# Altium schematic sheet Sheet1.SchDoc
size A2
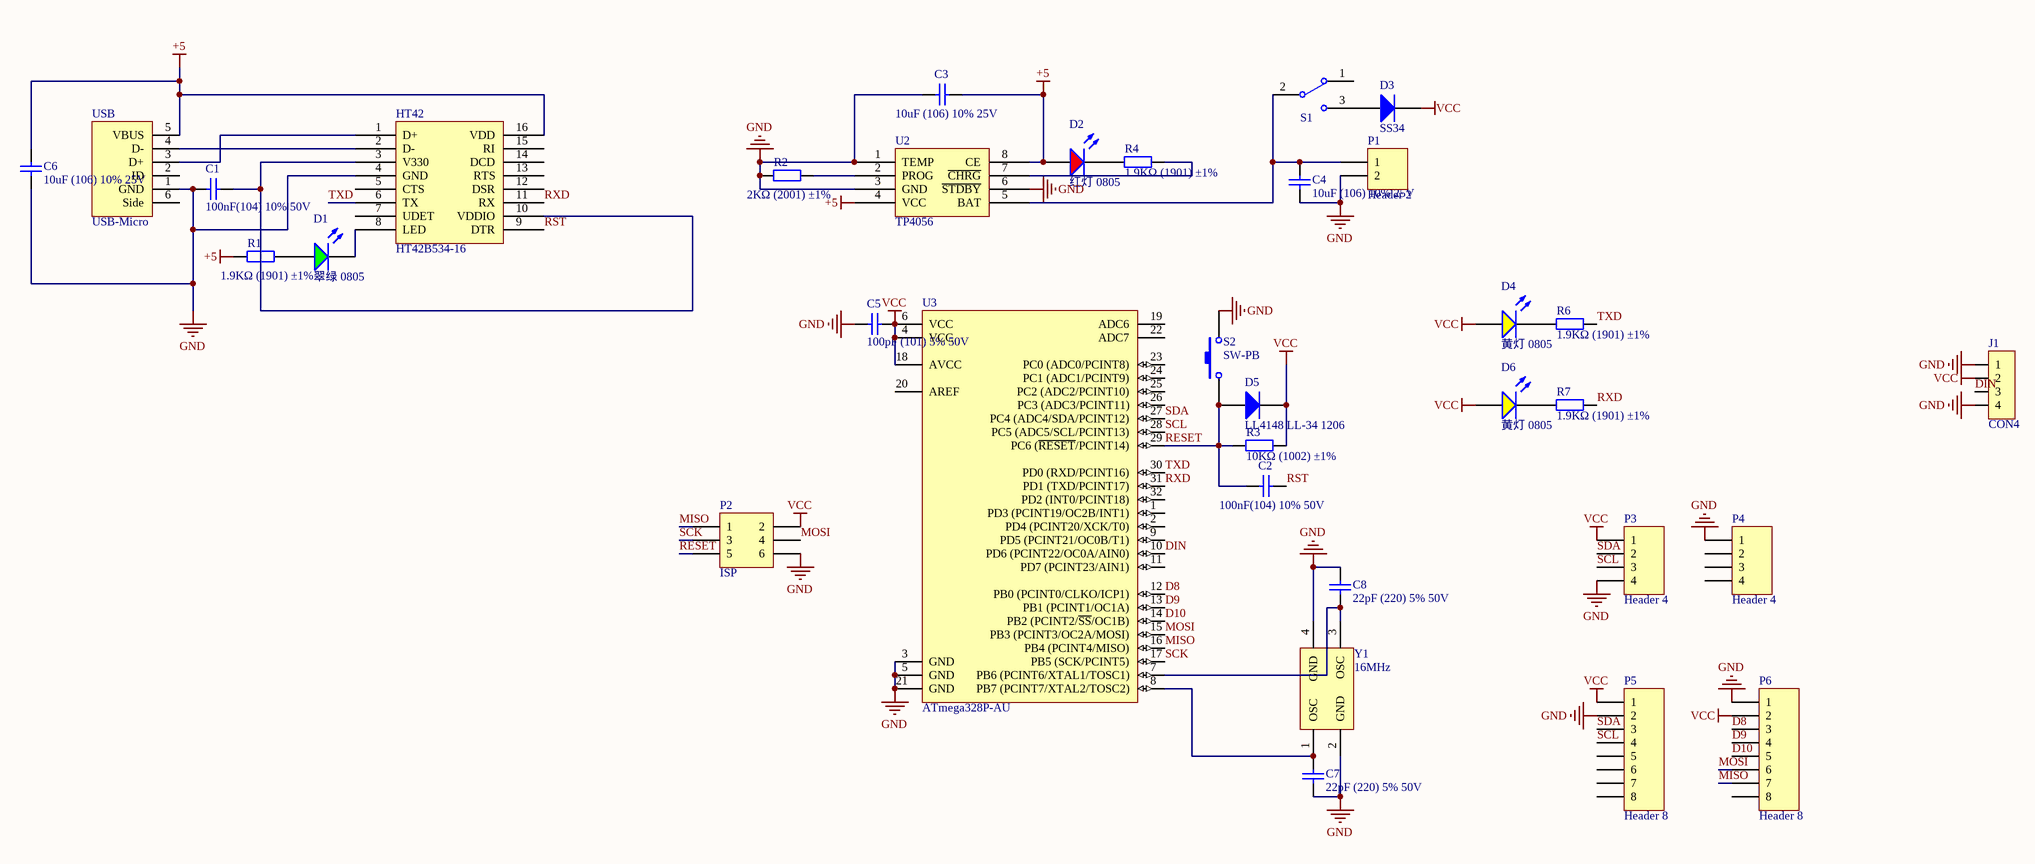
[diagram p0: Sheet1.SchDoc]

## Parts
C1  100nF(104) 10% 50V  [0805_C]
C2  100nF(104) 10% 50V  [0805_C]
C3  10uF (106) 10% 25V  [0805_C]
C4  10uF (106) 10% 25V  [0805_C]
C5  100pF (101) 5% 50V  [0805_C]
C6  10uF (106) 10% 25V  [0805_C]
C7  22pF (220) 5% 50V  [0805_C]
C8  22pF (220) 5% 50V  [0805_C]
D1  翠绿 0805  [0805_LED_S1]
D2  红灯 0805  [0805_LED_S1]
D3  SS34  [SMA(DO-214AC)_S1]
D4  黄灯 0805  [0805_LED_S1]
D5  LL4148 LL-34 1206  [LL-34]
D6  黄灯 0805  [0805_LED_S1]
HT42  HT42B534-16  [SOP-16]
J1  CON4  [XH-4]
P1  Header 2  [HDR1X2]
P2  ISP  [HDR2X3]
P3  Header 4  [HDR1X4]
P4  Header 4  [HDR1X4]
P5  Header 8  [HDR1X8]
P6  Header 8  [HDR1X8]
R1  1.9KΩ (1901) ±1%  [0805_R]
R2  2KΩ (2001) ±1%  [0805_R]
R3  10KΩ (1002) ±1%  [0805_R]
R4  1.9KΩ (1901) ±1%  [0805_R]
R6  1.9KΩ (1901) ±1%  [0805_R]
R7  1.9KΩ (1901) ±1%  [0805_R]
S1  SW  [HDR1X3]  (value not drawn)
S2  SW-PB  [SW_PB2_A1]
U2  TP4056  [SOP-8_EP_150mil]
U3  ATmega328P-AU  [32A_N]
USB  USB-Micro  [USB-Micro B]
Y1  16MHz  [X5032]

## Nets
+5: C3.2 C6.2 D2.A HT42.16(VDD) R1.1 U2.4(VCC) U2.8(CE) USB.5(VBUS)
GND: C1.1 C3.1 C4.1 C5.1 C6.1 C7.1 C8.2 HT42.4(GND) J1.1 J1.4 P1.2 P2.6 P3.4 P4.1 P5.2 P6.1 R2.1 S2.2 U2.1(TEMP) U2.3(GND) U2.6(~{STDBY}) U3.3(GND) U3.5(GND) U3.21(GND) USB.1(GND) Y1.2(GND) Y1.4(GND)
VCC: C5.2 D3.2(K) D4.A D5.2(K) D6.A J1.2 P2.2 P3.1 P5.1 P6.2 R3.2 U3.4(VCC) U3.6(VCC) U3.18(AVCC)
D8: P6.3 U3.12(PB0_(PCINT0/CLKO/ICP1))
D9: P6.4 U3.13(PB1_(PCINT1/OC1A))
D10: P6.5 U3.14(PB2_(PCINT2/~{SS}/OC1B))
DIN: J1.3 U3.10(PD6_(PCINT22/OC0A/AIN0))
MISO: P2.1 P6.7 U3.16(PB4_(PCINT4/MISO))
MOSI: P2.4 P6.6 U3.15(PB3_(PCINT3/OC2A/MOSI))
RESET: C2.1 D5.1(A) P2.5 R3.1 S2.1 U3.29(PC6_(~{RESET}/PCINT14))
RST: C2.2 HT42.9(DTR)
RXD: HT42.11(RX) R7.2 U3.31(PD1_(TXD/PCINT17))
SCK: P2.3 U3.17(PB5_(SCK/PCINT5))
SCL: P3.3 P5.4 U3.28(PC5_(ADC5/SCL/PCINT13))
SDA: P3.2 P5.3 U3.27(PC4_(ADC4/SDA/PCINT12))
TXD: HT42.6(TX) R6.2 U3.30(PD0_(RXD/PCINT16))
NetC1_2: C1.2 HT42.3(V330) HT42.10(VDDIO)
NetC4_2: C4.2 P1.1 S1.2(COMMON1) U2.5(BAT)
NetC7_2: C7.2 U3.8(PB7_(PCINT7/XTAL2/TOSC2)) Y1.1(OSC)
NetC8_1: C8.1 U3.7(PB6_(PCINT6/XTAL1/TOSC1)) Y1.3(OSC)
NetD1_A: D1.A R1.2
NetD1_K: D1.K HT42.8(LED)
NetD2_K: D2.K R4.1
NetD3_1: D3.1(A) S1.3(NO1)
NetD4_K: D4.K R6.1
NetD6_K: D6.K R7.1
NetHT42_1: HT42.1(D+) USB.3(D+)
NetHT42_2: HT42.2(D-) USB.4(D-)
NetR2_2: R2.2 U2.2(PROG)
NetR4_2: R4.2 U2.7(~{CHRG})

Not connected (* = marked no-connect by the designer): HT42 5(CTS) 7(UDET) 12(DSR) 13(RTS) 14(DCD) 15(RI); P4 2 3 4; P5 5 6 7 8; P6 8; S1 1(NC1); U3 1(PD3_(PCINT19/OC2B/INT1)) 2(PD4_(PCINT20/XCK/T0)) 9(PD5_(PCINT21/OC0B/T1)) 11(PD7_(PCINT23/AIN1)) 19(ADC6) 20(AREF) 22(ADC7) 23(PC0_(ADC0/PCINT8)) 24(PC1_(ADC1/PCINT9)) 25(PC2_(ADC2/PCINT10)) 26(PC3_(ADC3/PCINT11)) 32(PD2_(INT0/PCINT18)); USB 2(ID) 6(Side)

## Library data of the parts
C1 C2 = 0805 100nF(104) 10% 50V: 贴片电容; ComponentLink1Description: 供应商链接; ComponentLink1URL: http://www.szlcsc.com/product/details_50686.html; Package: 0805; Supplier: LC; SuppliersPartNumber: C49678
C3 C4 C6 = 0805 10uF (106) 10% 25V: 贴片电容; ComponentLink1Description: 供应商链接; ComponentLink1URL: http://www.szlcsc.com/product/details_16532.html; Package: 0805; Supplier: LC; SuppliersPartNumber: C15850
C5 = 0805 100pF (101) 5% 50V: 贴片电容; ComponentLink1Description: 供应商链接; ComponentLink1URL: http://www.szlcsc.com/product/details_2142.html; Package: 0805; Supplier: LC; SuppliersPartNumber: C1790
C7 C8 = 0805 22pF (220) 5% 50V: 贴片电容; ComponentLink1Description: 供应商链接; ComponentLink1URL: http://www.szlcsc.com/product/details_2156.html; Package: 0805; Supplier: LC; SuppliersPartNumber: C1804
D1 = 0805 翠绿: 发光二极管; ComponentLink1Description: 供应商链接; ComponentLink1URL: http://www.szlcsc.com/product/details_2670.html; Package: 0805; Supplier: LC; SuppliersPartNumber: C2297
D2 = 0805 红灯: 发光二极管; ComponentLink1Description: 供应商链接; ComponentLink1URL: http://www.szlcsc.com/product/details_2668.html; Package: 0805; Supplier: LC; SuppliersPartNumber: C2295
D3 = SMA(DO-214AC) SS210: 二极管; ComponentLink1Description: 供应商链接; ComponentLink1URL: http://www.szlcsc.com/product/details_15669.html; Package: SMA(DO-214AC); Supplier: LC; SuppliersPartNumber: C14996
D4 D6 = 0805 黄灯: 发光二极管; ComponentLink1Description: 供应商链接; ComponentLink1URL: http://www.szlcsc.com/product/details_2669.html; Package: 0805; Supplier: LC; SuppliersPartNumber: C2296
D5 = LL-34 LL4148 LL-34 1206: 开关二极管; ComponentLink1Description: 供应商链接; ComponentLink1URL: http://www.szlcsc.com/product/details_10338.html; Package: LL-34; Supplier: LC; SuppliersPartNumber: C9808
HT42 = HT42B534-16: USB_COM
J1 = CON4: Connector
P1 = Header 2: Header, 2-Pin; LatestRevisionDate: 17-Jul-2002; LatestRevisionNote: Re-released for DXP Platform.; Publisher: Altium Limited
P2 = Header 3X2: Header, 3-Pin, Dual row; LatestRevisionDate: 17-Jul-2002; LatestRevisionNote: Re-released for DXP Platform.; Publisher: Altium Limited
P3 P4 = Header 4: Header, 4-Pin; LatestRevisionDate: 17-Jul-2002; LatestRevisionNote: Re-released for DXP Platform.; Publisher: Altium Limited
P5 P6 = Header 8: Header, 8-Pin; LatestRevisionDate: 17-Jul-2002; LatestRevisionNote: Re-released for DXP Platform.; Publisher: Altium Limited
R1 R4 = 0805 1.8KΩ (1801) 1%: 贴片电阻; ComponentLink1Description: 供应商链接; ComponentLink1URL: http://www.szlcsc.com/product/details_18086.html; Package: 0805; Supplier: LC; SuppliersPartNumber: C17398
R2 = 0805 2KΩ (2001) 1%: 贴片电阻; ComponentLink1Description: 供应商链接; ComponentLink1URL: http://www.szlcsc.com/product/details_18292.html; Package: 0805; Supplier: LC; SuppliersPartNumber: C17604
R3 = 0805 10KΩ (1002) 1%: 贴片电阻; ComponentLink1Description: 供应商链接; ComponentLink1URL: http://www.szlcsc.com/product/details_18102.html; Package: 0805; Supplier: LC; SuppliersPartNumber: C17414
R6 R7 = 0805 1.5KΩ (1501) 1%: 贴片电阻; ComponentLink1Description: 供应商链接; ComponentLink1URL: http://www.szlcsc.com/product/details_4717.html; Package: 0805; Supplier: LC; SuppliersPartNumber: C4310
S1 = SW: Switch; Published: 24-Mar-1999; LatestRevisionDate: 29-May-2009; LatestRevisionNote: IPC-7351 Footprint Added.; PackageVersion: Mar-2001; PackageReference: SOT23-6; Publisher: Altium Limited; PackageDescription: 6-Pin SOT-23 Package 0.95 mm Pitch, 2.7 mm Lead Span; Code_JEITA: SC-74; Code_IPC: SOT26A-6
S2 = SW-PB: 微动开关; Published: 24-Mar-1999; LatestRevisionDate: 17-Jul-2002; LatestRevisionNote: Re-released for DXP Platform.; PackageReference: SPST-2; Publisher: Altium Limited
U2 = TP4056_[C16581]: 电池电源管理; ComponentLink1Description: 供应商链接; ComponentLink1URL: http://www.szlcsc.com/product/details_17264.html; Package: SOP-8_EP_150mil; Supplier: LC; SuppliersPartNumber: C16581
U3 = ATmega328P-AU: 8-bit AVR Microcontroller, 32KB Flash, 1KB EEPROM, 2KB SRAM, 32-pin TQFP, Industrial Grade (-40癈 to 85癈); Published: 1-Apr-2010; DatasheetVersion: revA, Jan-2010; PackageVersion: revB, Oct-2001; PackageReference: 32A; Publisher: Altium Limited; PackageDescription: 32-Lead, 7x7x1.0 mm Body, 0.8mm Lead Pitch, Thin Profile Plastic Quad Flat Package (TQFP); Supplier 1: Digi-Key; Supplier Part Number 1: ATMEGA328P-AU-ND; Supplier 2: Farnell; Supplier Part Number 2: 1715486; Supplier 3: Mouser; Supplier Part Number 3: 556-ATMEGA328P-AU; Code_JEDEC: MS-026-ABA; ComponentLink1Description: Manufacturer Link; ComponentLink1URL: http://www.atmel.com/products/avr/default.asp?; ComponentLink2Description: ATmega48A/48PA/88A/88PA/168A/168PA/328/328P Datasheet; ComponentLink2URL: http://www.atmel.com/dyn/resources/prod_documents/8271.pdf; ComponentLink3Description: ATmega48A/48PA/88A/88PA/168A/168PA/328/328P Summary; ComponentLink3URL: http://www.atmel.com/dyn/resources/prod_documents/8271S.pdf; ComponentLink4Description: Atmel.com Home; ComponentLink4URL: http://www.atmel.com
Y1 = XTAL_SMD2